# Altium schematic sheet Power_regulation.SchDoc
size A; SheetNumber: 3; SheetTotal: 7; SPICEModelCachePAJFOGTT: <root> / <DocumentId>PAJFOGTT</DocumentId> / </root>
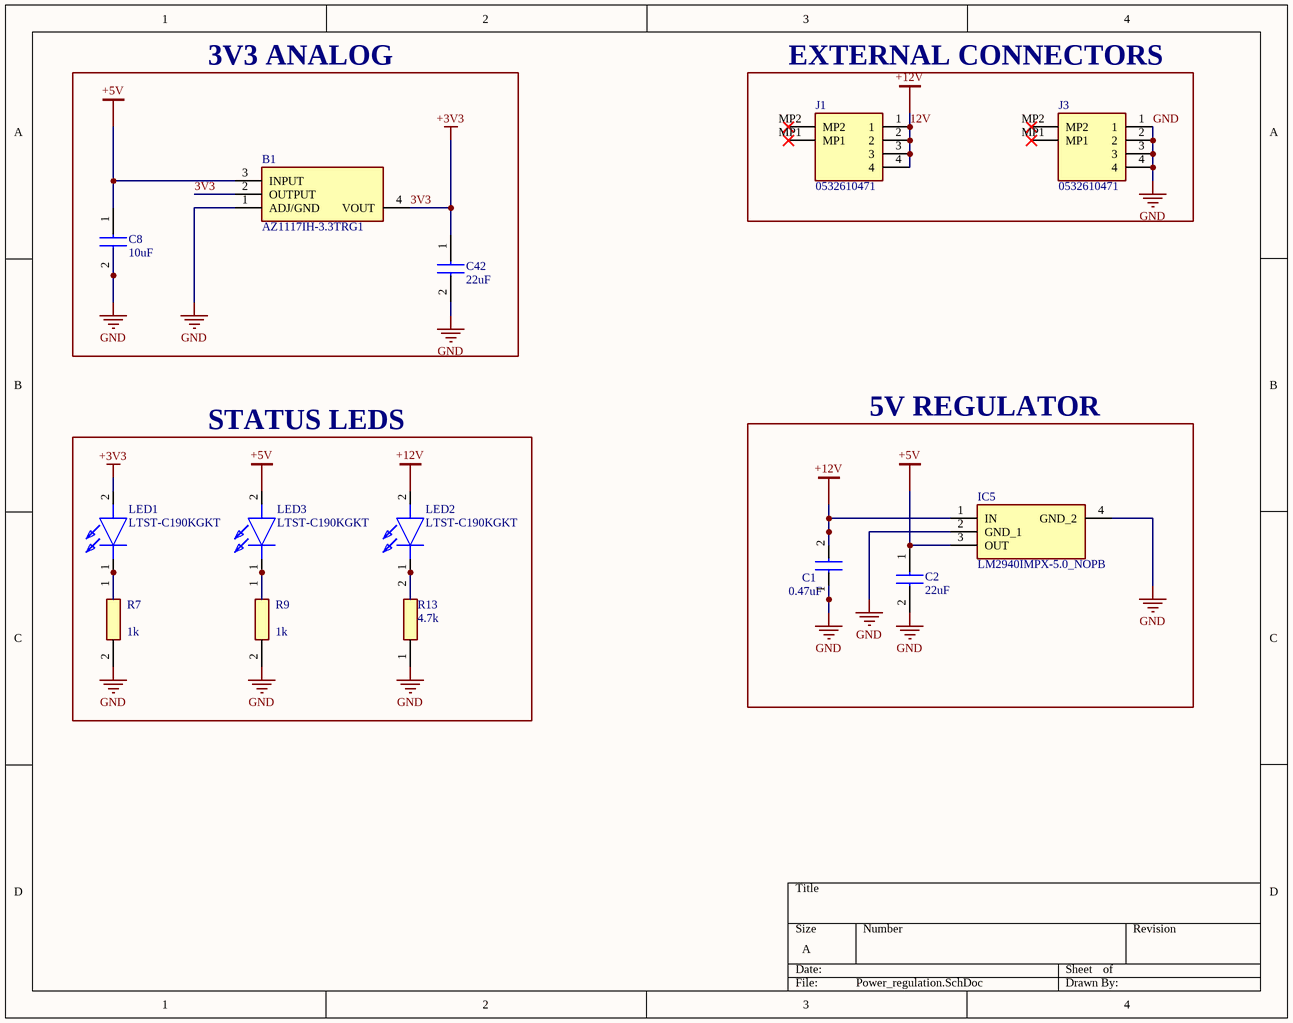
[diagram p0: Power_regulation.SchDoc]

## Parts
B1  AZ1117IH-3.3TRG1  [SOT230P700X180-4N]
C1  0.47uF  [CAPC1608X90N]
C2  22uF  [CAPC1608X100N]
C8  10uF  [GRM15x]
C42  22uF  [CAPC1608X100N]
IC5  LM2940IMPX-5.0_NOPB  [SOT230P700X180-4N]
J1  0532610471  [0532610471]
J3  0532610471  [0532610471]
LED1  LTST-C190KGKT  [LEDC1608X80N]
LED2  LTST-C190KGKT  [LEDC1608X80N]
LED3  LTST-C190KGKT  [LEDC1608X80N]
R7  1k  [RESC1608X55N]
R9  1k  [RESC1608X55N]
R13  4.7k  [RESC1608X55N]

## Blocks framed on the sheet
3V3 ANALOG: B1 C8 C42
EXTERNAL CONNECTORS: J1 J3
STATUS LEDS: LED1-LED3 R7 R9 R13
5V REGULATOR: C1 C2 IC5

## Nets
3V3: B1.2(OUTPUT) B1.4(VOUT) C42.1 LED1.2(A)  [also labelled +3V3]
12V: C1.2 IC5.1(IN) J1.1 J1.2 J1.3 J1.4 LED2.2(A)  [also labelled +12V]
+5V: B1.3(INPUT) C2.1 C8.1 IC5.3(OUT) LED3.2(A)
GND: B1.1(ADJ/GND) C1.1 C2.2 C8.2 C42.2 IC5.2(GND_1) IC5.4(GND_2) J3.1 J3.2 J3.3 J3.4 R7.2 R9.2 R13.1
NetLED1_1: LED1.1(K) R7.1
NetLED2_1: LED2.1(K) R13.2
NetLED3_1: LED3.1(K) R9.1

Not connected (* = marked no-connect by the designer): J1 MP1* MP2*; J3 MP1* MP2*

## Library data of the parts
B1 = CMP-027-000000-1: LDO Voltage Regulators LDO BJT HiCurr 1.35A 10Hz to 10KHz; Manufacturer_Name: Diodes Incorporated; Geometry.Height: 1.8mm; Manufacturer_Part_Number: AZ1117IH-3.3TRG1; Mouser Price/Stock: https://www.mouser.co.uk/ProductDetail/Diodes-Incorporated/AZ1117IH-3.3TRG1?qs=cpo3%2FpBou2jnS4SxLgAVoA%3D%3D; Arrow Part Number: AZ1117IH-3.3TRG1; Source: AZ1117IH-3.3TRG1.SchLib; Design Item ID: AZ1117IH-3.3TRG1; Datasheet Link: https://www.diodes.com//assets/Datasheets/AZ1117I.pdf; Arrow Price/Stock: https://www.arrow.com/en/products/az1117ih-3.3trg1/diodes-incorporated?utm_currency=USD&region=europe; Mouser Part Number: 621-AZ1117IH-3.3TRG1
C1 = GRM188R61H474KA12D: Manufacturer_Name: Murata Electronics; Datasheet Link: https://search.murata.co.jp/Ceramy/image/img/A01X/G101/ENG/GRM188R61H474KA12-04A.pdf; Height: 0.9mm; Manufacturer_Part_Number: GRM188R61H474KA12D; Mouser Part Number: 81-GRM188R61H474KA2D; Mouser Price/Stock: https://www.mouser.co.uk/ProductDetail/Murata-Electronics/GRM188R61H474KA12D?qs=4W3PNmGdEWHPXU2UiOr6Bg%3D%3D; Arrow Part Number: GRM188R61H474KA12D; Arrow Price/Stock: https://www.arrow.com/en/products/grm188r61h474ka12d/murata-manufacturing
C2 C42 = CC0603MRX5R6BB226: Manufacturer_Name: Yageo Group; Datasheet Link: https://www.yageo.com/upload/media/product/productsearch/datasheet/mlcc/UPY-GPHC_X5R_4V-to-50V_30.pdf; Height: 1mm; Manufacturer_Part_Number: CC0603MRX5R6BB226; Mouser Part Number: 603-CC603MRX5R6BB226; Mouser Price/Stock: https://www.mouser.co.uk/ProductDetail/YAGEO/CC0603MRX5R6BB226?qs=IvkZ4pJZlB3K%252BVkAL36Ang%3D%3D
C8 = GRM155R61A106ME11D: Manufacturer_Name: Murata Electronics; Datasheet Link: https://search.murata.co.jp/Ceramy/image/img/A01X/G101/ENG/GRM155R61A106ME11-01A.pdf; Height: 0.33mm; Manufacturer_Part_Number: GRM155R61A106ME11D; Mouser Part Number: 81-GRM155R61A106ME1D; Mouser Price/Stock: https://www.mouser.co.uk/ProductDetail/Murata-Electronics/GRM155R61A106ME11D?qs=xZ%2FP%252Ba9zWqZMJSi57Q8OyA%3D%3D; Arrow Part Number: GRM155R61A106ME11D; Arrow Price/Stock: https://www.arrow.com/en/products/grm155r61a106me11d/murata-manufacturing?utm_currency=USD&region=nac
IC5 = LM2940IMPX-5.0_NOPB: Integrated Circuit; Manufacturer_Name: Texas Instruments; Manufacturer_Part_Number: LM2940IMPX-5.0/NOPB; Datasheet Link: http://www.ti.com/lit/gpn/lm2940-n; Height: 1.8mm; Mouser Part Number: 926-LM2940IMPX50NOPB; Mouser Price/Stock: https://www.mouser.co.uk/ProductDetail/Texas-Instruments/LM2940IMPX-5.0-NOPB?qs=X1J7HmVL2ZELzMHXu8bpyQ%3D%3D; Arrow Part Number: LM2940IMPX-5.0/NOPB; Arrow Price/Stock: https://www.arrow.com/en/products/lm2940impx-5.0nopb/texas-instruments?utm_currency=USD&region=nac
J1 J3 = 0532610471: Connector; Manufacturer_Name: Molex; Datasheet Link: https://www.molex.com/en-us/products/part-detail-pdf/532610471?display=pdf; Height: 3.6mm; Manufacturer_Part_Number: 0532610471; Mouser Part Number: N/A; Mouser Price/Stock: https://www.mouser.co.uk/ProductDetail/Molex/0532610471?qs=PBcRNPEHKsrtKT62ep6ONg%3D%3D; Arrow Part Number: 0532610471; Arrow Price/Stock: https://www.arrow.com/en/products/0532610471/molex.html?utm_currency=USD&region=europe
LED1-LED3 = LTST-C190KGKT: LED; Manufacturer_Name: Lite-On; Datasheet Link: http://uk.rs-online.com/web/p/visible-leds/6920988/; Height: 0.8mm; Manufacturer_Part_Number: LTST-C190KGKT; Mouser Part Number: 859-LTST-C190KGKT; Mouser Price/Stock: https://www.mouser.co.uk/ProductDetail/Lite-On/LTST-C190KGKT?qs=205qCy6M2Q%252BAdcgwUZktqw%3D%3D; Arrow Part Number: LTST-C190KGKT; Arrow Price/Stock: https://www.arrow.com/en/products/ltst-c190kgkt/lite-on-technology?utm_currency=USD&region=nac
R7 R9 = RC0603FR-131KL: Manufacturer_Name: Yageo Group; Datasheet Link: http://www.yageo.com/documents/recent/PYu-RC0603_51_RoHS_L_v5.pdf; Height: 0.55mm; Manufacturer_Part_Number: RC0603FR-131KL; Mouser Part Number: 603-RC0603FR-131KL; Mouser Price/Stock: https://www.mouser.co.uk/ProductDetail/Yageo/RC0603FR-131KL?qs=EiqXWrxQq60RfsVJHVHHSQ%3D%3D; Arrow Part Number: RC0603FR-131KL; Arrow Price/Stock: https://www.arrow.com/en/products/rc0603fr-131kl/yageo
R13 = AC0603FR-074K7L: Manufacturer_Name: Yageo Group; Datasheet Link: https://www.mouser.in/ProductDetail/YAGEO/AC0603FR-074K7L?qs=UoPT7wUmgYKKC9qeAwzsVg%3D%3D; Height: 0.55mm; Manufacturer_Part_Number: AC0603FR-074K7L; Mouser Part Number: 603-AC0603FR-074K7L; Mouser Price/Stock: https://www.mouser.co.uk/ProductDetail/YAGEO/AC0603FR-074K7L?qs=UoPT7wUmgYKKC9qeAwzsVg%3D%3D; Arrow Part Number: AC0603FR-074K7L; Arrow Price/Stock: https://www.arrow.com/en/products/ac0603fr-074k7l/yageo?region=europe